# EAGLE design super_como_r1 (EAGLE 9.3.0)
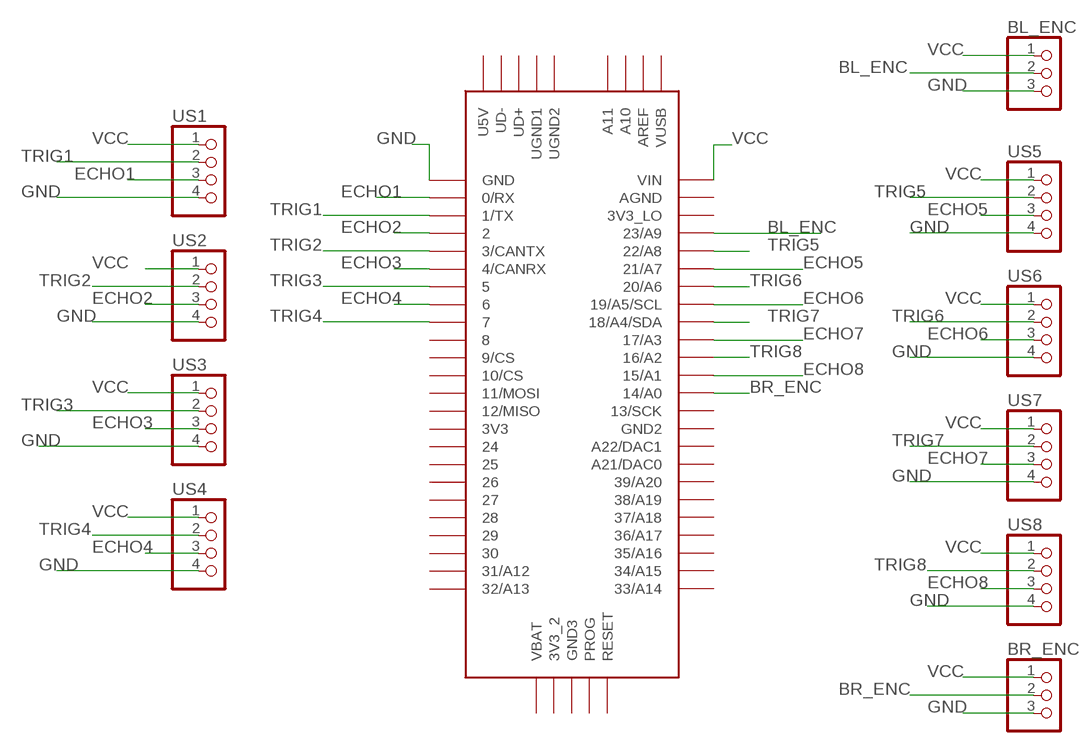
[diagram p0: schematic, sheet 1]

## Parts
BL_ENC  PINHD-1X3/90  [1X03/90]
BR_ENC  PINHD-1X3/90  [1X03/90]
U$1  TEENSY_3.5/3.6  [TEENSY_3.5/3.6]
US1  PINHD-1X4/90  [1X04/90]
US2  PINHD-1X4/90  [1X04/90]
US3  PINHD-1X4/90  [1X04/90]
US4  PINHD-1X4/90  [1X04/90]
US5  PINHD-1X4/90  [1X04/90]
US6  PINHD-1X4/90  [1X04/90]
US7  PINHD-1X4/90  [1X04/90]
US8  PINHD-1X4/90  [1X04/90]

## Nets
BL_ENC: BL_ENC.2 U$1.23/A9
BR_ENC: BR_ENC.2 U$1.14/A0
ECHO1: U$1.0/RX US1.3
ECHO2: U$1.2 US2.3
ECHO3: U$1.4/CANRX US3.3
ECHO4: U$1.6 US4.3
ECHO5: U$1.21/A7 US5.3
ECHO6: U$1.19/A5/SCL US6.3
ECHO7: U$1.17/A3 US7.3
ECHO8: U$1.15/A1 US8.3
GND: BL_ENC.3 BR_ENC.3 U$1.GND US1.4 US2.4 US3.4 US4.4 US5.4 US6.4 US7.4 US8.4
TRIG1: U$1.1/TX US1.2
TRIG2: U$1.3/CANTX US2.2
TRIG3: U$1.5 US3.2
TRIG4: U$1.7 US4.2
TRIG5: U$1.22/A8 US5.2
TRIG6: U$1.20/A6 US6.2
TRIG7: U$1.18/A4/SDA US7.2
TRIG8: U$1.16/A2 US8.2
VCC: BL_ENC.1 BR_ENC.1 U$1.VIN US1.1 US2.1 US3.1 US4.1 US5.1 US6.1 US7.1 US8.1
Unconnected: U$1.3V3 U$1.3V3_2 U$1.3V3_LO U$1.8 U$1.9/CS U$1.10/CS U$1.11/MOSI U$1.12/MISO U$1.13/SCK U$1.21/DAC0(A21/DAC0) U$1.24 U$1.25 U$1.26 U$1.27 U$1.28 U$1.29 U$1.30 U$1.31/A12 U$1.32/A13 U$1.33/A14 U$1.34/A15 U$1.35/A16 U$1.36/A17 U$1.37/A18 U$1.38/A19 U$1.39/A20 U$1.A10 U$1.A11 U$1.A22/DAC1 U$1.AGND U$1.AREF U$1.GND2 U$1.GND3 U$1.PROG U$1.RESET U$1.U5V U$1.UD+ U$1.UD- U$1.UGND1 U$1.UGND2 U$1.VBAT U$1.VUSB

## Library data of the parts
BL_ENC BR_ENC = pinhead:PINHD-1X3: PIN HEADER
U$1 = Teensy356:TEENSY_3.5/3.6
US1-US8 = pinhead:PINHD-1X4: PIN HEADER

## Net classes
0 default: width 0.508 mm, drill 0.762 mm, clearance 1.016 mm

## Board
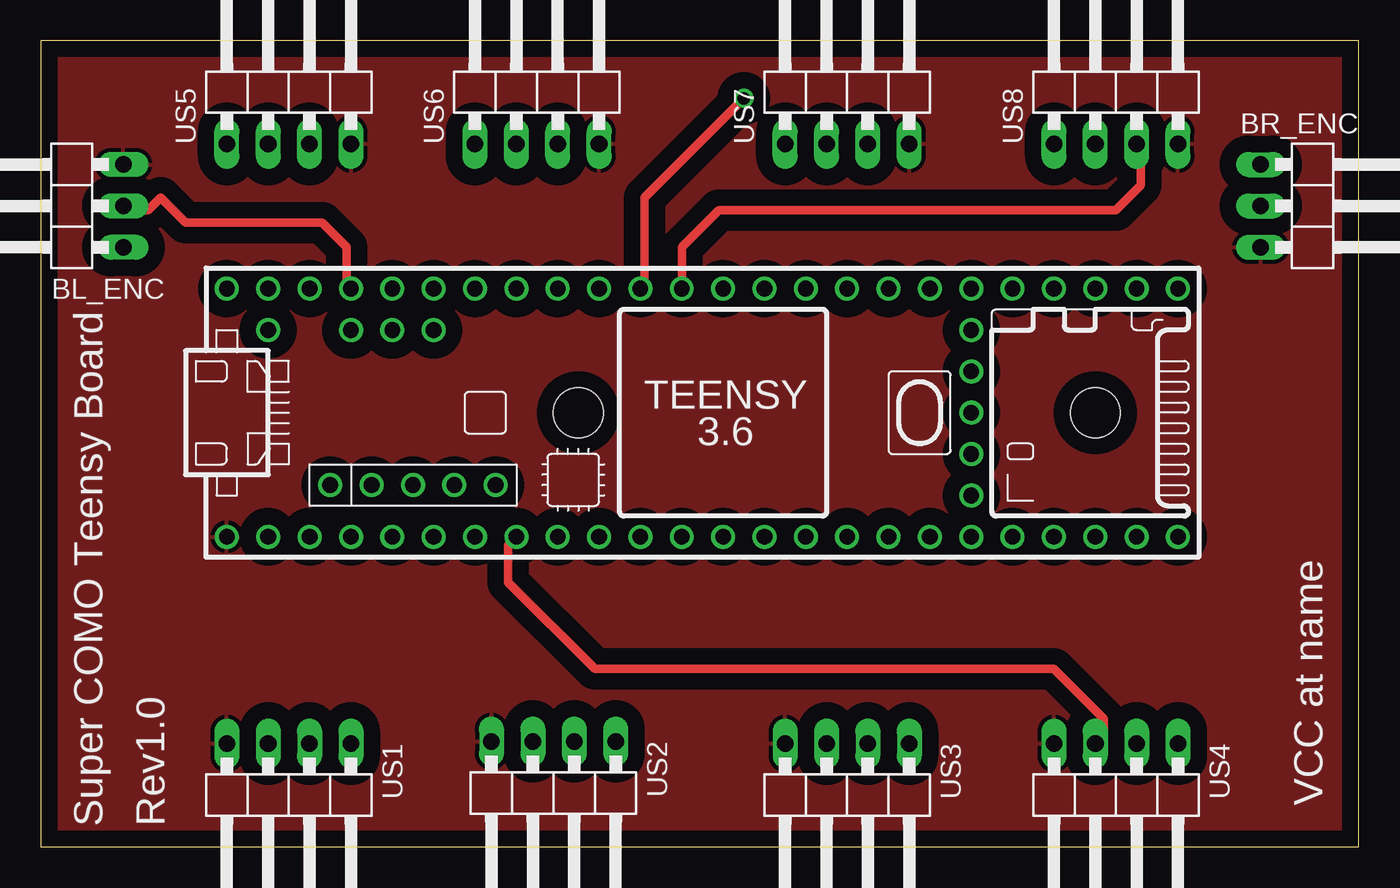
[diagram p1: board, top side]
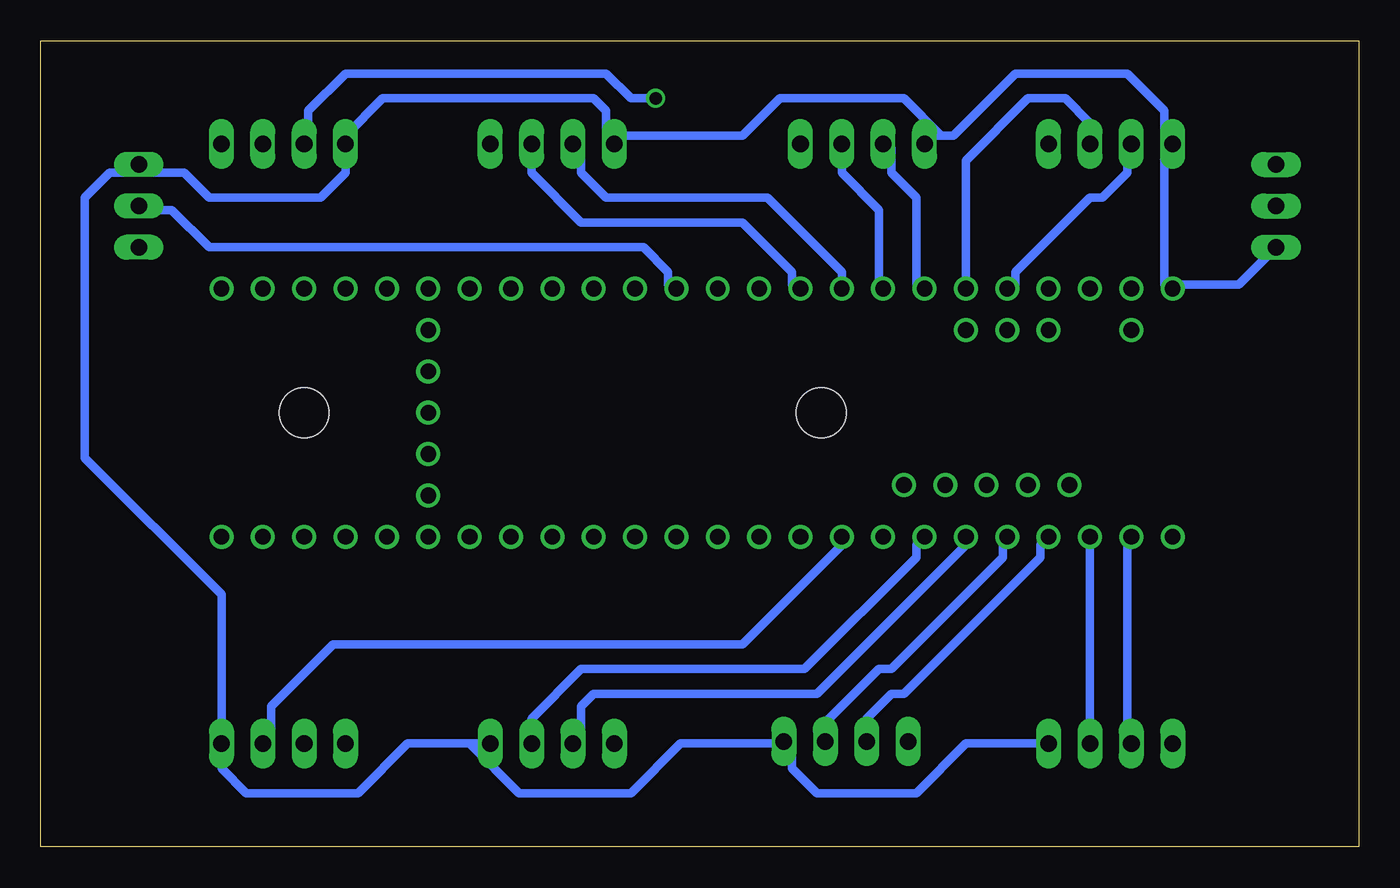
[diagram p2: board, bottom side, seen from below]

Size 80.95 x 49.52 mm. Coordinates in mm from the lower left corner, seen from the top.
Outline: 0,0 80.95,0 80.95,49.52 0,49.52 0,0
Copper layers (1*16): Top 0.035mm / dielectric 1.5mm / Bottom 0.035mm
Design rules "default": minimum track width 6mil, minimum drill 0.35mm, track to track 6mil, track to pad 6mil, pad to pad 6mil, via to via 6mil, smd to smd 6mil, copper to edge 40mil, drill to drill 6mil, minimum pad ring 10mil, minimum via ring 8mil, stop-mask expansion 4mil, vias tented up to drill 0mil, thermal gap 10mil
Holes 3.05 mm at 64.77,26.67 33.02,26.67

### Footprints (pad centres in the part's own frame; a part is rotated, then mirrored left to right if it is on the bottom)
1X03/90 = drill 1.016 long: 1 -2.54,-3.81; 2 0,-3.81; 3 2.54,-3.81
TEENSY_3.5/3.6 = drill 0.965: 0/RX -25.4,-7.62; 1/TX -22.86,-7.62; 2 -20.32,-7.62; 3/CANTX -17.78,-7.62; 3V3 7.62,-7.62; 3V3_2 17.78,-2.54; 3V3_LO -22.86,7.62; 4/CANRX -15.24,-7.62; 5 -12.7,-7.62; 6 -10.16,-7.62; 7 -7.62,-7.62; 8 -5.08,-7.62; 9/CS -2.54,-7.62; 10/CS 0,-7.62; 11/MOSI 2.54,-7.62; 12/MISO 5.08,-7.62; 13/SCK 5.08,7.62; 14/A0 2.54,7.62; 15/A1 0,7.62; 16/A2 -2.54,7.62; 17/A3 -5.08,7.62; 18/A4/SDA -7.62,7.62; 19/A5/SCL -10.16,7.62; 20/A6 -12.7,7.62; 21/A7 -15.24,7.62; 21/DAC0 12.7,7.62; 22/A8 -17.78,7.62; 23/A9 -20.32,7.62; 24 10.16,-7.62; 25 12.7,-7.62; 26 15.24,-7.62; 27 17.78,-7.62; 28 20.32,-7.62; 29 22.86,-7.62; 30 25.4,-7.62; 31/A12 27.94,-7.62; 32/A13 30.48,-7.62; 33/A14 30.48,7.62; 34/A15 27.94,7.62; 35/A16 25.4,7.62; 36/A17 22.86,7.62; 37/A18 20.32,7.62; 38/A19 17.78,7.62; 39/A20 15.24,7.62; A10 -17.78,5.08; A11 -15.24,5.08; A22/DAC1 10.16,7.62; AGND -25.4,7.62; AREF -20.32,5.08; GND -27.94,-7.62; GND2 7.62,7.62; GND3 17.78,0; PROG 17.78,2.54; RESET 17.78,5.08; U5V -21.59,-4.445; UD+ -16.51,-4.445; UD- -19.05,-4.445; UGND1 -13.97,-4.445; UGND2 -11.43,-4.445; VBAT 17.78,-5.08; VIN -27.94,7.62; VUSB -25.4,5.08
1X04/90 = drill 1.016 long: 1 -3.81,-3.81; 2 -1.27,-3.81; 3 1.27,-3.81; 4 3.81,-3.81

### Placement (x,y rotation side)
BL_ENC  1.27,39.37 90 top
BR_ENC  78.74,39.37 270 top
U$1  39.37,26.67 0 top
US1  15.24,2.54 180 top
US2  31.5,2.67 180 top
US3  49.53,2.54 180 top
US4  66.04,2.54 180 top
US5  15.24,46.99 0 top
US6  30.48,46.99 0 top
US7  49.53,46.99 0 top
US8  66.04,46.99 0 top

### Tracks (layer width: path | path; a pad name or v marks a point on that pad's centre or on a via)
BL_ENC
  Top 0.508: U$1.23/A9 18.8,34.54 18.8,36.83 17.27,38.35 8.89,38.35 7.37,39.88 6.6,39.12 5.08,39.12 BL_ENC.2
BR_ENC
  Bottom 0.508: U$1.14/A0 42.42,34.54 42.42,35.31 43.94,36.83 70.61,36.83 72.9,39.12 74.42,39.12 BR_ENC.2
ECHO1
  Bottom 0.508: U$1.0/RX 14.22,18.54 14.22,6.35 US1.3
ECHO2
  Bottom 0.508: US2.3 30.23,7.87 28.7,9.4 27.94,9.4 19.56,17.78 19.56,18.54 U$1.2
ECHO3
  Bottom 0.508: U$1.4/CANRX 24.13,18.54 33.27,9.4 46.99,9.4 47.75,8.64 47.75,6.35 US3.3
ECHO4
  Top 0.508: U$1.6 28.7,18.54 28.7,16.26 34.04,10.92 62.23,10.92 65.28,7.87 65.28,6.35 US4.3
ECHO5
  Bottom 0.508: U$1.21/A7 24.13,42.16 20.32,45.97 18.03,45.97 16.51,44.45 US5.3
ECHO6
  Bottom 0.508: US6.3 31.75,41.4 29.46,39.12 29.46,34.54 U$1.19/A5/SCL
ECHO7
  Bottom 0.508: US7.3 50.8,41.4 47.75,38.35 37.85,38.35 34.8,35.31 34.8,34.54 U$1.17/A3
ECHO8
  Top 0.508: U$1.15/A1 39.37,36.83 41.66,39.12 66.04,39.12 67.56,40.64 67.56,42.93 US8.3
GND
  pour Top: -11.43,58.42 -11.43,-10.16 92.71,-10.16 92.71,58.42
TRIG1
  Bottom 0.508: US1.2 U$1.1/TX
TRIG2
  Bottom 0.508: U$1.3/CANTX 21.84,18.54 21.84,17.78 28.7,10.92 29.46,10.92 33.27,7.11 US2.2
TRIG3
  Bottom 0.508: US3.2 50.8,7.87 47.75,10.92 34.04,10.92 27.18,17.78 27.18,18.54 U$1.5
TRIG4
  Bottom 0.508: U$1.7 31.75,18.54 37.85,12.45 62.99,12.45 66.8,8.64 66.8,6.35 US4.2
TRIG5
  Bottom 0.508: U$1.22/A8 21.08,34.54 21.08,35.31 16.51,39.88 15.75,39.88 14.22,41.4 14.22,42.93 US5.2
TRIG6
  Bottom 0.508: U$1.20/A6 27.18,34.54 27.18,39.88 28.7,41.4 28.7,42.93 US6.2
TRIG7
  Bottom 0.508: U$1.18/A4/SDA 31.75,35.31 36.32,39.88 46.23,39.88 47.75,41.4 47.75,42.93 US7.2
TRIG8  (via drill 0.76)
  Top 0.508: v43.18,45.97 37.08,39.88 37.08,34.54 U$1.16/A2
  Bottom 0.508: v43.18,45.97 44.7,45.97 46.23,47.5 62.23,47.5 64.52,45.21 64.52,43.69 US8.2
VCC
  Bottom 0.508: US1.1 24.13,6.35 27.18,3.3 33.27,3.3 34.8,4.83 34.8,6.35 US2.1 35.56,6.35 41.66,6.35 44.7,3.3 51.56,3.3 54.61,6.35 | 54.61,6.35 58.42,6.35 61.47,3.3 68.33,3.3 69.85,4.83 US4.1 69.85,15.49 78.23,23.88 78.23,39.88 76.71,41.4 75.18,41.4 BR_ENC.1 74.42,41.4 72.14,41.4 70.61,39.88 63.75,39.88 62.23,41.4 US8.1 62.23,43.69 59.94,45.97 46.99,45.97 46.23,45.21 46.23,43.69 US7.1 45.47,43.69 37.85,43.69 35.56,45.97 27.94,45.97 25.65,43.69 | 54.61,6.35 US3.1 | BL_ENC.1 7.37,34.54 11.18,34.54 U$1.VIN 11.94,34.54 11.94,42.93 US5.1 11.94,43.69 11.94,45.21 14.22,47.5 21.08,47.5 24.89,43.69 25.65,43.69 | 25.65,43.69 26.42,43.69 US6.1

### Text on the board
tPlace: VCC at name | Super COMO Teensy Board | Rev1.0